# EAGLE schematic Cassette Port (EAGLE 9.6.2)
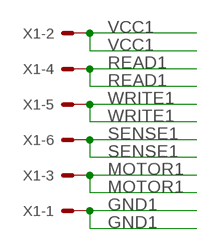
[diagram p0: schematic, sheet 1]

## Parts
X1  22-23-2061  [22-23-2061]

## Nets
GND1: X1.1
MOTOR1: X1.3
READ1: X1.4
SENSE1: X1.6
VCC1: X1.2
WRITE1: X1.5

## Library data of the parts
X1 = con-molex:22-23-2061: .100" (2.54mm) Center Header - 6 Pin; MF: MOLEX; MPN: 22-23-2061; OC_FARNELL: 1462922; OC_NEWARK: 27C1933